# Altium schematic sheet MemoriaEEPROM.V03.R00.SchDoc: Memoria EEPROM
size A4; SheetNumber: 17; SheetTotal: 18
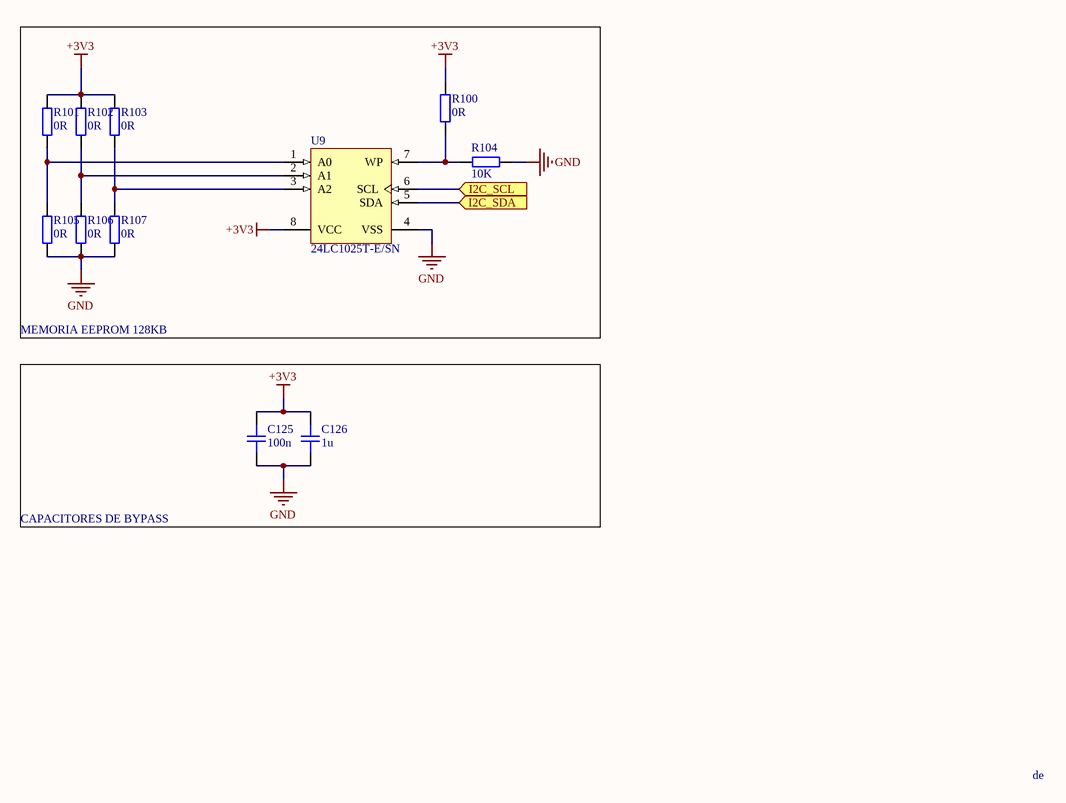
[diagram p0: MemoriaEEPROM.V03.R00.SchDoc]

## Parts
C125  100n  [CAP_0805]
C126  1u  [CAP_0805]
R100  0R  [RES_0805]
R101  0R  [RES_0805]
R102  0R  [RES_0805]
R103  0R  [RES_0805]
R104  10K  [RES_0805]
R105  0R  [RES_0805]
R106  0R  [RES_0805]
R107  0R  [RES_0805]
U9  24LC1025T-E/SN  [SOIC-SN8_M]

## Blocks framed on the sheet
MEMORIA EEPROM 128KB: R100-R107 U9
CAPACITORES DE BYPASS: C125 C126

## Ports
I2C_SCL (in), I2C_SDA (in)

## Nets
+3V3: C125.2 C126.2 R100.2 R101.2 R102.2 R103.2 U9.8(VCC)
GND: C125.1 C126.1 R104.2 R105.1 R106.1 R107.1 U9.4(VSS)
I2C_SCL: U9.6(SCL) ; port I2C_SCL
I2C_SDA: U9.5(SDA) ; port I2C_SDA
NetR100_1: R100.1 R104.1 U9.7(WP)
NetR101_1: R101.1 R105.2 U9.1(A0)
NetR102_1: R102.1 R106.2 U9.2(A1)
NetR103_1: R103.1 R107.2 U9.3(A2)

## Notes on the sheet
- de

## Library data of the parts
C125 C126 = CAP_0805: Capacitor SMD 0805; Manufacturer: *; Manufacturer Part Number: *; Distributor Link: *; LCSC: *; Rating: *; Dielectric: *
R100-R107 = RES_0805: Resistor SMD 0805; Manufacturer: *; Manufacturer Part Number: *; Distributor Link: *; LCSC: *
U9 = CMP-0159-00340-1: 1 Mbit, 400kHz, 2.5V, 8-Pin SOIC 150mil, Extended Temperature, Tape and Reel; Code_JEDEC: MS-012; PackageVersion: revBB, Aug-2009; PackageDescription: 8-Lead Plastic Small Outline (SN) - Narrow, 3.90mm Body [SOIC]; DatasheetVersion: revF, Oct-2008; PackageReference: SOIC-SN8; Code_IPC: SOIC127P600-8